# Altium project Concentrator.PrjPCB
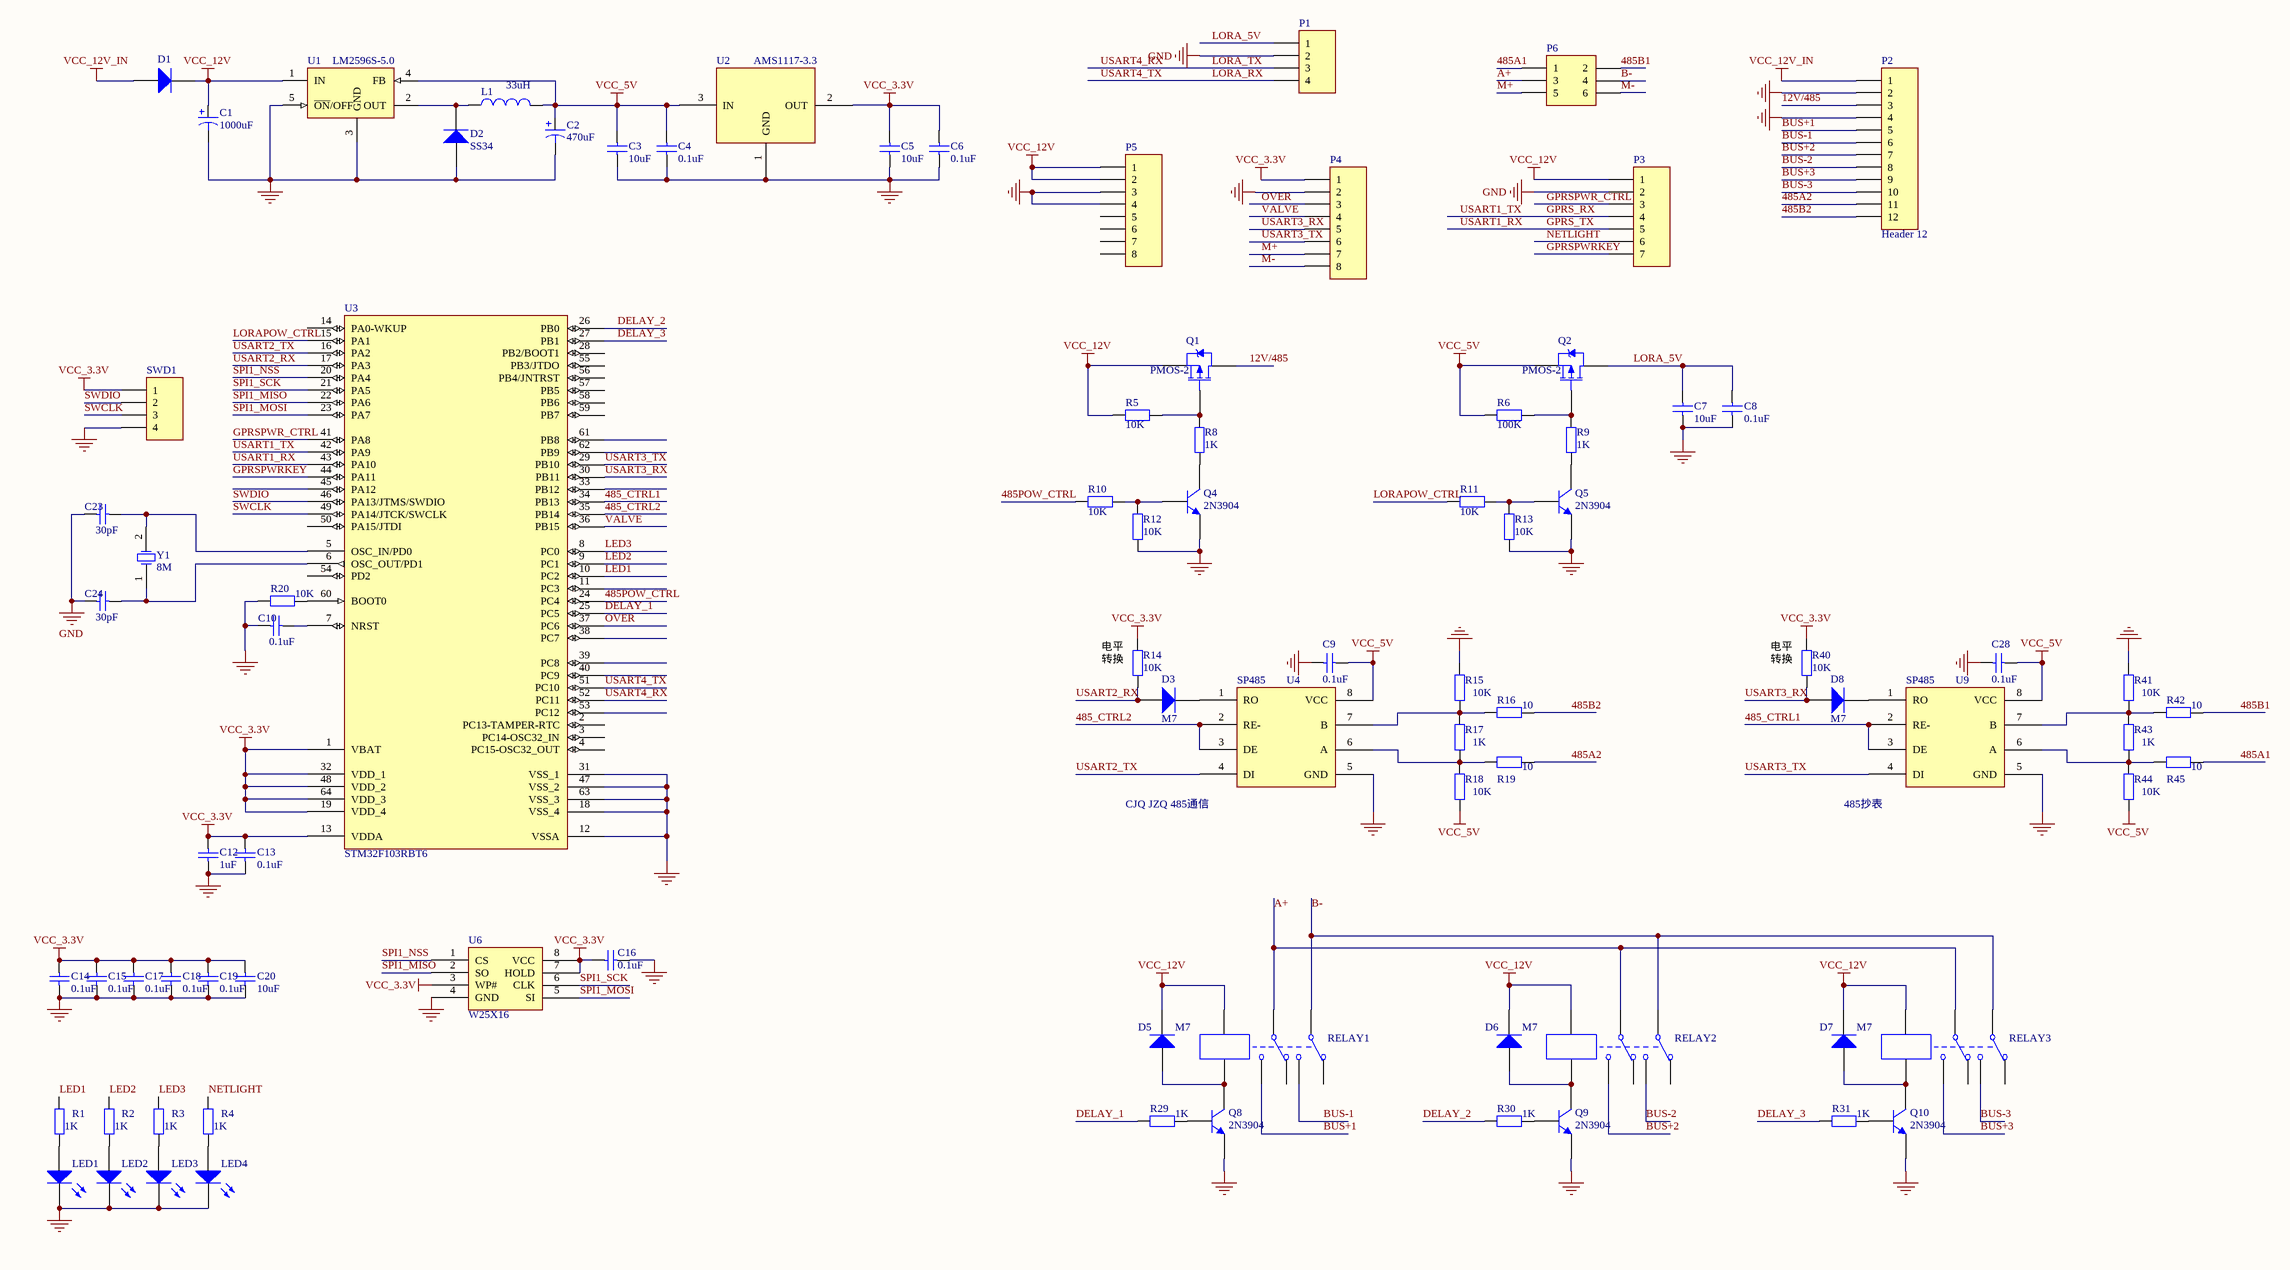
[diagram p0: Concentrator.SchDoc]
3 sheets, 167 parts. Net scope: global (net labels, ports and power ports of the same name join across sheets).
Board files: Concentrator.PcbDoc, SIM800.PcbDoc, Concentrator1.PcbDoc, MBUS_Slave.PcbDoc
Sheets:
  Concentrator.SchDoc
  SIM800.SchDoc
  JunPuMBUS.SchDoc

## Sheet Concentrator.SchDoc
size A2

### Parts
(Parts that share a designator on the sheet are numbered #1, #2 ... from top to bottom, then left to right.)
C1#1  value 1000uF  [C_DJ - duplicate]  (hidden comment: Cap Pol1)
C2#1  value 470uF  [C_DJ - duplicate]  (hidden comment: Cap Pol1)
C3#1  value 10uF  [0805]  (hidden comment: Cap)
C4#1  value 0.1uF  [0603]  (hidden comment: Cap)
C5#1  value 10uF  [0805]  (hidden comment: Cap)
C6#1  value 0.1uF  [0603]  (hidden comment: Cap)
C7  value 10uF  [0805]  (hidden comment: Cap)
C8  value 0.1uF  [0603]  (hidden comment: Cap)
C9  value 0.1uF  [0603]  (hidden comment: Cap)
C10  value 0.1uF  [0603]  (hidden comment: Cap)
C12  value 1uF  [0603]  (hidden comment: Cap)
C13  value 0.1uF  [0603]  (hidden comment: Cap)
C14  value 0.1uF  [0603]  (hidden comment: Cap)
C15  value 0.1uF  [0603]  (hidden comment: Cap)
C16  value 0.1uF  [0603]  (hidden comment: Cap)
C17  value 0.1uF  [0603]  (hidden comment: Cap)
C18  value 0.1uF  [0603]  (hidden comment: Cap)
C19  value 0.1uF  [0603]  (hidden comment: Cap)
C20  value 10uF  [0805]  (hidden comment: Cap)
C23#1  value 30pF  [0603]  (hidden comment: Cap)
C24#1  value 30pF  [0603]  (hidden comment: Cap)
C28  value 0.1uF  [0603]  (hidden comment: Cap)
D1  Diode 1N4007  [M7-4007]  (value not drawn)
D2  SS34  [M7-4007]
D3  M7  [M7-4007]
D5#1  M7  [M7-4007]
D6  M7  [M7-4007]
D7#1  M7  [M7-4007]
D8  M7  [M7-4007]
L1  value 33uH  [L12*12]  (hidden comment: Inductor)
LED1  LED  [LED]  (value not drawn)
LED2  LED  [LED]  (value not drawn)
LED3  LED  [LED]  (value not drawn)
LED4  LED  [LED]  (value not drawn)
P1  Header 4  [HDR1X4]  (value not drawn)
P2  Header 12  [P12]
P3  Header 7  [HDR1X7]  (value not drawn)
P4#1  Header 8  [HDR1X8]  (value not drawn)
P5#1  Header 8  [HDR1X8]  (value not drawn)
P6  Header 3X2  [HDR2X3]  (value not drawn)
Q1#1  PMOS-2  [78M05/20]
Q2#1  PMOS-2  [78M05/20]
Q4  2N3904  [NPN-PNP]
Q5  2N3904  [NPN-PNP]
Q8  2N3904  [NPN-PNP]
Q9  2N3904  [NPN-PNP]
Q10#1  2N3904  [NPN-PNP]
R1#1  value 1K  [0603]  (hidden comment: Res2)
R2#1  value 1K  [0603]  (hidden comment: Res2)
R3#1  value 1K  [0603]  (hidden comment: Res2)
R4#1  value 1K  [0603]  (hidden comment: Res2)
R5#1  value 10K  [0603]  (hidden comment: Res2)
R6#1  value 100K  [0603]  (hidden comment: Res2)
R8#1  value 1K  [0603]  (hidden comment: Res2)
R9#1  value 1K  [0603]  (hidden comment: Res2)
R10#1  value 10K  [0603]  (hidden comment: Res2)
R11#1  value 10K  [0603]  (hidden comment: Res2)
R12#1  value 10K  [0603]  (hidden comment: Res2)
R13#1  value 10K  [0603]  (hidden comment: Res2)
R14#1  value 10K  [0603]  (hidden comment: Res2)
R15#1  value 10K  [0603]  (hidden comment: Res2)
R16#1  value 10  [0603]  (hidden comment: Res2)
R17#1  value 1K  [0603]  (hidden comment: Res2)
R18#1  value 10K  [0603]  (hidden comment: Res2)
R19#1  value 10  [0603]  (hidden comment: Res2)
R20#1  value 10K  [0603]  (hidden comment: Res2)
R29#1  value 1K  [0603]  (hidden comment: Res2)
R30#1  value 1K  [0603]  (hidden comment: Res2)
R31#1  value 1K  [0603]  (hidden comment: Res2)
R40  value 10K  [0603]  (hidden comment: Res2)
R41  value 10K  [0603]  (hidden comment: Res2)
R42  value 10  [0603]  (hidden comment: Res2)
R43  value 1K  [0603]  (hidden comment: Res2)
R44  value 10K  [0603]  (hidden comment: Res2)
R45  value 10  [0603]  (hidden comment: Res2)
RELAY1#1  Relay-DPDT  [Relay-DPDP]  (value not drawn)
RELAY2  Relay-DPDT  [Relay-DPDP]  (value not drawn)
RELAY3  Relay-DPDT  [Relay-DPDP]  (value not drawn)
SWD1  SWD  [HDR1X4]  (value not drawn)
U1#1  LM2596S-5.0  [TO-263-5]
U2#1  AMS1117-3.3  [AMS-1117]
U3#1  STM32F103RBT6  [LQFP64_M]
U4#1  SP485  [SOP8]
U6  W25X16  [W24X16]
U9  SP485  [SOP8]
Y1  8M  [OSC]

### Nets
M-: C1#1.2 C2#1.2 C3#1.1 C4#1.1 C5#1.1 C6#1.1 C7.1 C8.1 C9.2 C10.1 C12.1 C13.1 C14.1 C15.1 C16.1 C17.1 C18.1 C19.1 C20.1 C23#1.1 C24#1.1 C28.2 D2.1(A) LED1.K LED2.K LED3.K LED4.K P1.2 P2.2 P2.4 P3.2 P4#1.2 P4#1.8 P5#1.3 P5#1.4 P6.6 Q4.E Q5.E Q8.E Q9.E Q10#1.E R12#1.1 R13#1.1 R15#1.1 R20#1.1 R41.1 SWD1.4 U1#1.3(GND) U1#1.5(~{ON}/OFF) U2#1.1(GND) U3#1.12(VSSA) U3#1.18(VSS_4) U3#1.31(VSS_1) U3#1.47(VSS_2) U3#1.63(VSS_3) U4#1.5(GND) U6.4(GND) U9.5(GND)  [also labelled GND]
VCC_3.3V: C5#1.2 C6#1.2 C12.2 C13.2 C14.2 C15.2 C16.2 C17.2 C18.2 C19.2 C20.2 P4#1.1 R14#1.1 R40.1 SWD1.1 U2#1.2(OUT) U3#1.1(VBAT) U3#1.13(VDDA) U3#1.19(VDD_4) U3#1.32(VDD_1) U3#1.48(VDD_2) U3#1.64(VDD_3) U6.3(WP#) U6.7(HOLD) U6.8(VCC)
VCC_5V: C2#1.1 C3#1.2 C4#1.2 C9.1 C28.1 L1.2 Q2#1.3(S) R6#1.2 R18#1.2 R44.2 U1#1.4(FB) U2#1.3(IN) U4#1.8(VCC) U9.8(VCC)
VCC_12V: C1#1.1 D1.2(K) D5#1.2(K) D6.2(K) D7#1.2(K) P3.1 P5#1.1 P5#1.2 Q1#1.3(S) R5#1.2 RELAY1#1.7 RELAY2.7 RELAY3.7 U1#1.1(IN)
VCC_12V_IN: D1.1(A) P2.1
12V/485: P2.3 Q1#1.2(D)
485_CTRL1: U3#1.34(PB13) U9.2(RE-) U9.3(DE)
485_CTRL2: U3#1.35(PB14) U4#1.2(RE-) U4#1.3(DE)
485A1: P6.1 R45.2
485A2: P2.11 R19#1.2
485B1: P6.2 R42.2
485B2: P2.12 R16#1.2
485POW_CTRL: R10#1.1 U3#1.24(PC4)
A+: P6.3 RELAY1#1.4 RELAY2.4 RELAY3.4
B-: P6.4 RELAY1#1.1 RELAY2.1 RELAY3.1
BUS+1: P2.5 RELAY1#1.6
BUS+2: P2.7 RELAY2.6
BUS+3: P2.9 RELAY3.6
BUS-1: P2.6 RELAY1#1.3
BUS-2: P2.8 RELAY2.3
BUS-3: P2.10 RELAY3.3
DELAY_1: R29#1.1 U3#1.25(PC5)
DELAY_2: R30#1.1 U3#1.26(PB0)
DELAY_3: R31#1.1 U3#1.27(PB1)
GPRS_RX: P3.4 U3#1.42(PA9)  [also labelled USART1_TX]
GPRS_TX: P3.5 U3#1.43(PA10)  [also labelled USART1_RX]
GPRSPWR_CTRL: P3.3 U3#1.41(PA8)
GPRSPWRKEY: P3.7 U3#1.44(PA11)
LED1: R1#1.1 U3#1.10(PC2)
LED2: R2#1.1 U3#1.9(PC1)
LED3: R3#1.1 U3#1.8(PC0)
LORA_5V: C7.2 C8.2 P1.1 Q2#1.2(D)
LORA_RX: P1.4 U3#1.51(PC10)  [also labelled USART4_TX]
LORA_TX: P1.3 U3#1.52(PC11)  [also labelled USART4_RX]
LORAPOW_CTRL: R11#1.1 U3#1.15(PA1)
M+: P4#1.7 P6.5
NETLIGHT: P3.6 R4#1.1
OVER: P4#1.3 U3#1.37(PC6)
SPI1_MISO: U3#1.22(PA6) U6.2(SO)
SPI1_MOSI: U3#1.23(PA7) U6.5(SI)
SPI1_NSS: U3#1.20(PA4) U6.1(CS)
SPI1_SCK: U3#1.21(PA5) U6.6(CLK)
SWCLK: SWD1.3 U3#1.49(PA14/JTCK/SWCLK)
SWDIO: SWD1.2 U3#1.46(PA13/JTMS/SWDIO)
USART2_RX: D3.1(A) R14#1.2 U3#1.17(PA3)
USART2_TX: U3#1.16(PA2) U4#1.4(DI)
USART3_RX: D8.1(A) P4#1.5 R40.2 U3#1.30(PB11)
USART3_TX: P4#1.6 U3#1.29(PB10) U9.4(DI)
VALVE: P4#1.4 U3#1.36(PB15)
NetC10_2: C10.2 U3#1.7(NRST)
NetC23#1_2: C23#1.2 U3#1.5(OSC_IN/PD0) Y1.2(OSC2)
NetC24#1_2: C24#1.2 U3#1.6(OSC_OUT/PD1) Y1.1(OSC1)
NetD2_2: D2.2(K) L1.1 U1#1.2(OUT)
NetD3_2: D3.2(K) U4#1.1(RO)
NetD5#1_1: D5#1.1(A) Q8.C RELAY1#1.8
NetD6_1: D6.1(A) Q9.C RELAY2.8
NetD7#1_1: D7#1.1(A) Q10#1.C RELAY3.8
NetD8_2: D8.2(K) U9.1(RO)
NetLED1_A: LED1.A R1#1.2
NetLED2_A: LED2.A R2#1.2
NetLED3_A: LED3.A R3#1.2
NetLED4_A: LED4.A R4#1.2
NetQ1#1_1: Q1#1.1(G) R5#1.1 R8#1.2
NetQ2#1_1: Q2#1.1(G) R6#1.1 R9#1.2
NetQ4_B: Q4.B R10#1.2 R12#1.2
NetQ4_C: Q4.C R8#1.1
NetQ5_B: Q5.B R11#1.2 R13#1.2
NetQ5_C: Q5.C R9#1.1
NetQ8_B: Q8.B R29#1.2
NetQ9_B: Q9.B R30#1.2
NetQ10#1_B: Q10#1.B R31#1.2
NetR15#1_2: R15#1.2 R16#1.1 R17#1.1 U4#1.7(B)
NetR17#1_2: R17#1.2 R18#1.1 R19#1.1 U4#1.6(A)
NetR20#1_2: R20#1.2 U3#1.60(BOOT0)
NetR41_2: R41.2 R42.1 R43.1 U9.7(B)
NetR43_2: R43.2 R44.1 R45.1 U9.6(A)

Not connected (* = marked no-connect by the designer): P5#1 5 6 7 8; RELAY1#1 2 5; RELAY2 2 5; RELAY3 2 5; U2#1 4(OUT); U3#1 2(PC13-TAMPER-RTC) 3(PC14-OSC32_IN) 4(PC15-OSC32_OUT) 11(PC3) 14(PA0-WKUP) 28(PB2/BOOT1) 33(PB12) 38(PC7) 39(PC8) 40(PC9) 45(PA12) 50(PA15/JTDI) 53(PC12) 54(PD2) 55(PB3/JTDO) 56(PB4/JNTRST) 57(PB5) 58(PB6) 59(PB7) 61(PB8) 62(PB9)

### Notes on the sheet
- (near R14#1) 电平
  转换
- (near R40) 电平
  转换
- (near U4#1) CJQ JZQ 485通信
- (near U9) 485抄表

### Library data of the parts
C1#1 C2#1 = Cap Pol1: Polarized Capacitor (Radial); Published: 8-Jun-2000; LatestRevisionDate: 17-Jul-2002; LatestRevisionNote: Re-released for DXP Platform.; PackageReference: RB7.6-15; Publisher: Altium Limited
C3#1 C4#1 C5#1 C6#1 C7-C10 C12-C20 C23#1 C24#1 C28 = Cap: Capacitor; Published: 8-Jun-2000; LatestRevisionDate: 17-Jul-2002; LatestRevisionNote: Re-released for DXP Platform.; PackageReference: RAD-0.3; Publisher: Altium Limited
D1-D3 D5#1 D6 D7#1 D8 = Diode 1N4007: 1 Amp General Purpose Rectifier; Published: 8-Jun-2000; LatestRevisionDate: 17-Jul-2002; LatestRevisionNote: Re-released for DXP Platform.; PackageReference: DO-41; Publisher: Altium Limited; Code_JEDEC: DO-204-AL; ComponentLink1Description: Manufacturer Link; ComponentLink1URL: http://www.fairchildsemi.com/; ComponentLink2Description: Datasheet; ComponentLink2URL: http://www.fairchildsemi.com/ds/1N%2F1N4001.pdf
  D1 D2: DatasheetVersion: 1998; PackageVersion: Aug-1999
  D3 D5#1 D6 D7#1 D8: DatasheetDocument: 1998; PackageDocument: Aug-1999
L1 = Inductor: Code_IEC: 1005; Published: 8-Jun-2000; LatestRevisionDate: 29-May-2009; LatestRevisionNote: IPC-7351 Footprint Added.; PackageReference: 0402-A; Publisher: Altium Limited; PackageDescription: Chip Inductor; Code_JEITA: 0402
LED1-LED4 = LED0: Typical INFRARED GaAs LED; Published: 8-Jun-2000; LatestRevisionDate: 08-Jul-2005; LatestRevisionNote: Mech Layer 1 removed.; PackageReference: LED-0; Publisher: Altium Limited
P1 SWD1 = Header 4: Header, 4-Pin; LatestRevisionDate: 17-Jul-2002; LatestRevisionNote: Re-released for DXP Platform.; Publisher: Altium Limited
P2 = Header 12: Header, 12-Pin; LatestRevisionDate: 17-Jul-2002; LatestRevisionNote: Re-released for DXP Platform.; Publisher: Altium Limited
P3 = Header 7: Header, 7-Pin; LatestRevisionDate: 17-Jul-2002; LatestRevisionNote: Re-released for DXP Platform.; Publisher: Altium Limited
P4#1 P5#1 = Header 8: Header, 8-Pin; LatestRevisionDate: 17-Jul-2002; LatestRevisionNote: Re-released for DXP Platform.; Publisher: Altium Limited
P6 = Header 3X2: Header, 3-Pin, Dual row; LatestRevisionDate: 17-Jul-2002; LatestRevisionNote: Re-released for DXP Platform.; Publisher: Altium Limited
Q1#1 Q2#1 = PMOS-2: P-Channel Power MOSFET; Note: Pin 4 not drawn and electrically connected to Pin 2.; Published: 8-Jun-2000; LatestRevisionDate: 17-Jul-2002; LatestRevisionNote: Re-released for DXP Platform.; DatasheetVersion: PD-9.390D; PackageReference: TO-220AB; Publisher: Altium Limited; Code_JEDEC: TO-220-AB; ComponentLink1Description: Manufacturer Link; ComponentLink1URL: http://www.irf.com/
Q4 Q5 Q8 Q9 Q10#1 = 2N3904: NPN General Purpose Amplifier; Published: 8-Jun-2000; LatestRevisionDate: 15-Jan-2003; LatestRevisionNote: PCB Footprint 'BCY-W3/D4.7' replaced; PackageReference: TO-92A; Publisher: Altium Limited; Code_JEDEC: TO-92A; ComponentLink1Description: Manufacturer Link; ComponentLink1URL: http://www.fairchildsemi.com/; ComponentLink2Description: Datasheet; ComponentLink2URL: http://www.fairchildsemi.com/ds/2N%2F2N3904.pdf
  Q4 Q5: DatasheetVersion: 1997; PackageVersion: Sep-1998
  Q8 Q9 Q10#1: DatasheetDocument: 1997; PackageDocument: Sep-1998
R1#1 R2#1 R3#1 R4#1 R5#1 R6#1 R8#1 R9#1 R10#1 R11#1 R12#1 R13#1 R14#1 R15#1 R16#1 R17#1 R18#1 R19#1 R20#1 R29#1 R30#1 R31#1 R40-R45 = Res2: Resistor; Published: 8-Jun-2000; LatestRevisionDate: 17-Jul-2002; LatestRevisionNote: Re-released for DXP Platform.; PackageReference: AXIAL-0.4; Publisher: Altium Limited
RELAY1#1 RELAY2 RELAY3 = Relay-DPDT: Dual-Pole Dual-Throw Relay; Published: 24-Mar-1999; LatestRevisionDate: 17-Jul-2002; LatestRevisionNote: Re-released for DXP Platform.; PackageReference: DIP-P8; Publisher: Altium Limited
U1#1 = LM2596S-5.0: 5V稳压芯片; Note: Tab is connected to GND; Published: 15-Apr-2002; DatasheetVersion: Dec-1997; PackageReference: TS5B; Publisher: Altium Limited; PackageDescription: D2-PAK; 5 Leads; Body 14.4 (inc. leads) x 10.4 mm (LxW max); ComponentLink1Description: Manufacturer Link; ComponentLink1URL: http://www.national.com/; ComponentLink2Description: Datasheet; ComponentLink2URL: http://www.national.com/ds.cgi/LM/LM2596.pdf; ComponentLink3Description: URL Link1; ComponentLink3URL: http://www.national.com/pf/LM/LM2596.html
U3#1 = STM32F103RBT6: STM32 ARM-based 32-bit MCU with 128 Kbytes Flash, 64-pin LQFP, Industrial Temperature; Published: 30-May-2008; DatasheetVersion: rev6, Mar-2008; PackageVersion: Mar-2008; PackageReference: LQFP64; Publisher: Altium Limited; PackageDescription: 64-Pin Low-Profile Quad Flat Pack, 10 x 10 mm Body, 0.5 mm Pitch (LQFP64); ComponentLink1Description: Manufacturer Link; ComponentLink1URL: www.st.com/stm32; ComponentLink2Description: Datasheet; ComponentLink2URL: http://www.st.com/stonline/products/literature/ds/13587.pdf
U4#1 U9 = Pro55.tmp_SP485_20
U6 = W24X16
Y1 = XTAL: Crystal Oscillator; Published: 8-Jun-2000; LatestRevisionDate: 17-Jul-2002; LatestRevisionNote: Re-released for DXP Platform.; PackageReference: R38; Publisher: Altium Limited

## Sheet SIM800.SchDoc
size A4
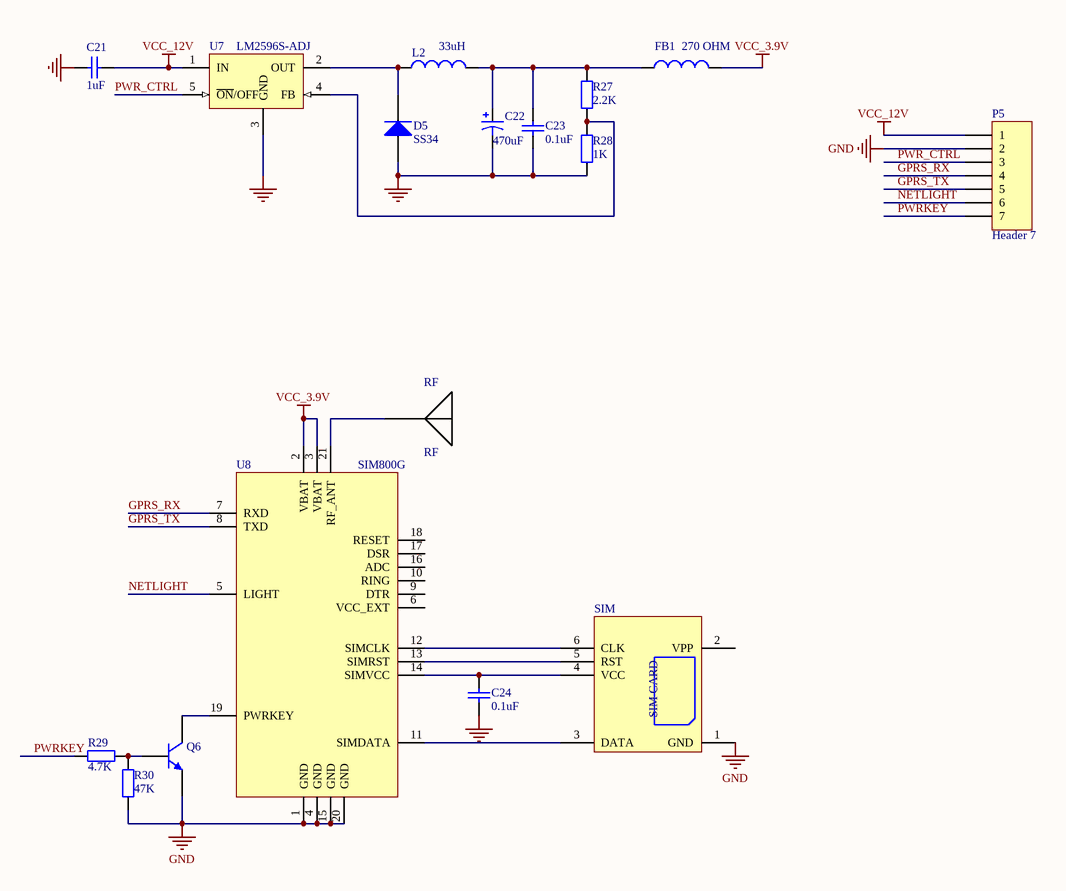
[diagram p1: SIM800.SchDoc]

### Parts
(Parts that share a designator on the sheet are numbered #1, #2 ... from top to bottom, then left to right.)
C21  value 1uF  [0603]  (hidden comment: Cap)
C22  value 470uF  [C_DJ - duplicate]  (hidden comment: Cap Pol1)
C23#2  value 0.1uF  [0603]  (hidden comment: Cap)
C24#2  value 0.1uF  [0603]  (hidden comment: Cap)
D5#2  SS34  [M7-4007]
FB1  value 270 OHM  [0805]  (hidden comment: Inductor)
L2  value 33uH  [L12*12]  (hidden comment: Inductor)
P5#2  Header 7  [HDR1X7]
Q6  (no value)  [NPN-PNP]
R27#1  value 2.2K  [0603]  (hidden comment: Res2)
R28#1  value 1K  [0603]  (hidden comment: Res2)
R29#2  value 4.7K  [0603]  (hidden comment: Res2)
R30#2  value 47K  [0603]  (hidden comment: Res2)
RF  RF  [RF_2]
SIM  (no value)  [SIMCARD]
U7  LM2596S-ADJ  [TO-263-5]
U8  SIM800G  [M590E_1]

### Nets
GND: C21.2 C22.2 C23#2.1 C24#2.2 D5#2.1(A) P5#2.2 Q6.E R28#1.2 R30#2.2 SIM.1(GND) U7.3(GND) U8.1(GND) U8.4(GND) U8.15(GND) U8.20(GND)  [project net M-]
VCC_3.9V: FB1.2 U8.2(VBAT) U8.3(VBAT)
VCC_12V: C21.1 P5#2.1 U7.1(IN)
GPRS_RX: P5#2.4 U8.7(RXD)
GPRS_TX: P5#2.5 U8.8(TXD)
NETLIGHT: P5#2.6 U8.5(LIGHT)
PWR_CTRL: P5#2.3 U7.5(~{ON}/OFF)
PWRKEY: P5#2.7 R29#2.1
NetC22_1: C22.1 C23#2.2 FB1.1 L2.2 R27#1.1
NetC24#2_1: C24#2.1 SIM.4(VCC) U8.14(SIMVCC)
NetD5#2_2: D5#2.2(K) L2.1 U7.2(OUT)
NetQ6_B: Q6.B R29#2.2 R30#2.1
NetQ6_C: Q6.C U8.19(PWRKEY)
NetR27#1_2: R27#1.2 R28#1.1 U7.4(FB)
NetRF_1: RF.1(RF) U8.21(RF_ANT)
NetSIM_3: SIM.3(DATA) U8.11(SIMDATA)
NetSIM_5: SIM.5(RST) U8.13(SIMRST)
NetSIM_6: SIM.6(CLK) U8.12(SIMCLK)

Not connected (* = marked no-connect by the designer): SIM 2(VPP); U8 6(VCC_EXT) 9(DTR) 10(RING) 16(ADC) 17(DSR) 18(RESET)

### Library data of the parts
C21 C23#2 C24#2 = Cap: Capacitor; Published: 8-Jun-2000; LatestRevisionDate: 17-Jul-2002; LatestRevisionNote: Re-released for DXP Platform.; PackageReference: RAD-0.3; Publisher: Altium Limited
C22 = Cap Pol1: Polarized Capacitor (Radial); Published: 8-Jun-2000; LatestRevisionDate: 17-Jul-2002; LatestRevisionNote: Re-released for DXP Platform.; PackageReference: RB7.6-15; Publisher: Altium Limited
D5#2 = Diode 1N4007: 1 Amp General Purpose Rectifier; Published: 8-Jun-2000; LatestRevisionDate: 17-Jul-2002; LatestRevisionNote: Re-released for DXP Platform.; DatasheetVersion: 1998; PackageVersion: Aug-1999; PackageReference: DO-41; Publisher: Altium Limited; Code_JEDEC: DO-204-AL; ComponentLink1Description: Manufacturer Link; ComponentLink1URL: http://www.fairchildsemi.com/; ComponentLink2Description: Datasheet; ComponentLink2URL: http://www.fairchildsemi.com/ds/1N%2F1N4001.pdf
FB1 L2 = Inductor: Code_IEC: 1005; Published: 8-Jun-2000; LatestRevisionDate: 29-May-2009; LatestRevisionNote: IPC-7351 Footprint Added.; PackageReference: 0402-A; Publisher: Altium Limited; PackageDescription: Chip Inductor; Code_JEITA: 0402
P5#2 = Header 7: Header, 7-Pin; LatestRevisionDate: 17-Jul-2002; LatestRevisionNote: Re-released for DXP Platform.; Publisher: Altium Limited
Q6 = 2N3904: NPN General Purpose Amplifier; Published: 8-Jun-2000; LatestRevisionDate: 15-Jan-2003; LatestRevisionNote: PCB Footprint 'BCY-W3/D4.7' replaced; DatasheetDocument: 1997; PackageDocument: Sep-1998; PackageReference: TO-92A; Publisher: Altium Limited; Code_JEDEC: TO-92A; ComponentLink1Description: Manufacturer Link; ComponentLink1URL: http://www.fairchildsemi.com/; ComponentLink2Description: Datasheet; ComponentLink2URL: http://www.fairchildsemi.com/ds/2N%2F2N3904.pdf
R27#1 R28#1 R29#2 R30#2 = Res2: Resistor; Published: 8-Jun-2000; LatestRevisionDate: 17-Jul-2002; LatestRevisionNote: Re-released for DXP Platform.; PackageReference: AXIAL-0.4; Publisher: Altium Limited
SIM = SIM_CARD: SIM CARD
U7 = LM2596S-5.0: 5V稳压芯片; Note: Tab is connected to GND; Published: 15-Apr-2002; DatasheetVersion: Dec-1997; PackageReference: TS5B; Publisher: Altium Limited; PackageDescription: D2-PAK; 5 Leads; Body 14.4 (inc. leads) x 10.4 mm (LxW max); ComponentLink1Description: Manufacturer Link; ComponentLink1URL: http://www.national.com/; ComponentLink2Description: Datasheet; ComponentLink2URL: http://www.national.com/ds.cgi/LM/LM2596.pdf; ComponentLink3Description: URL Link1; ComponentLink3URL: http://www.national.com/pf/LM/LM2596.html
U8 = M590

## Sheet JunPuMBUS.SchDoc
size A3
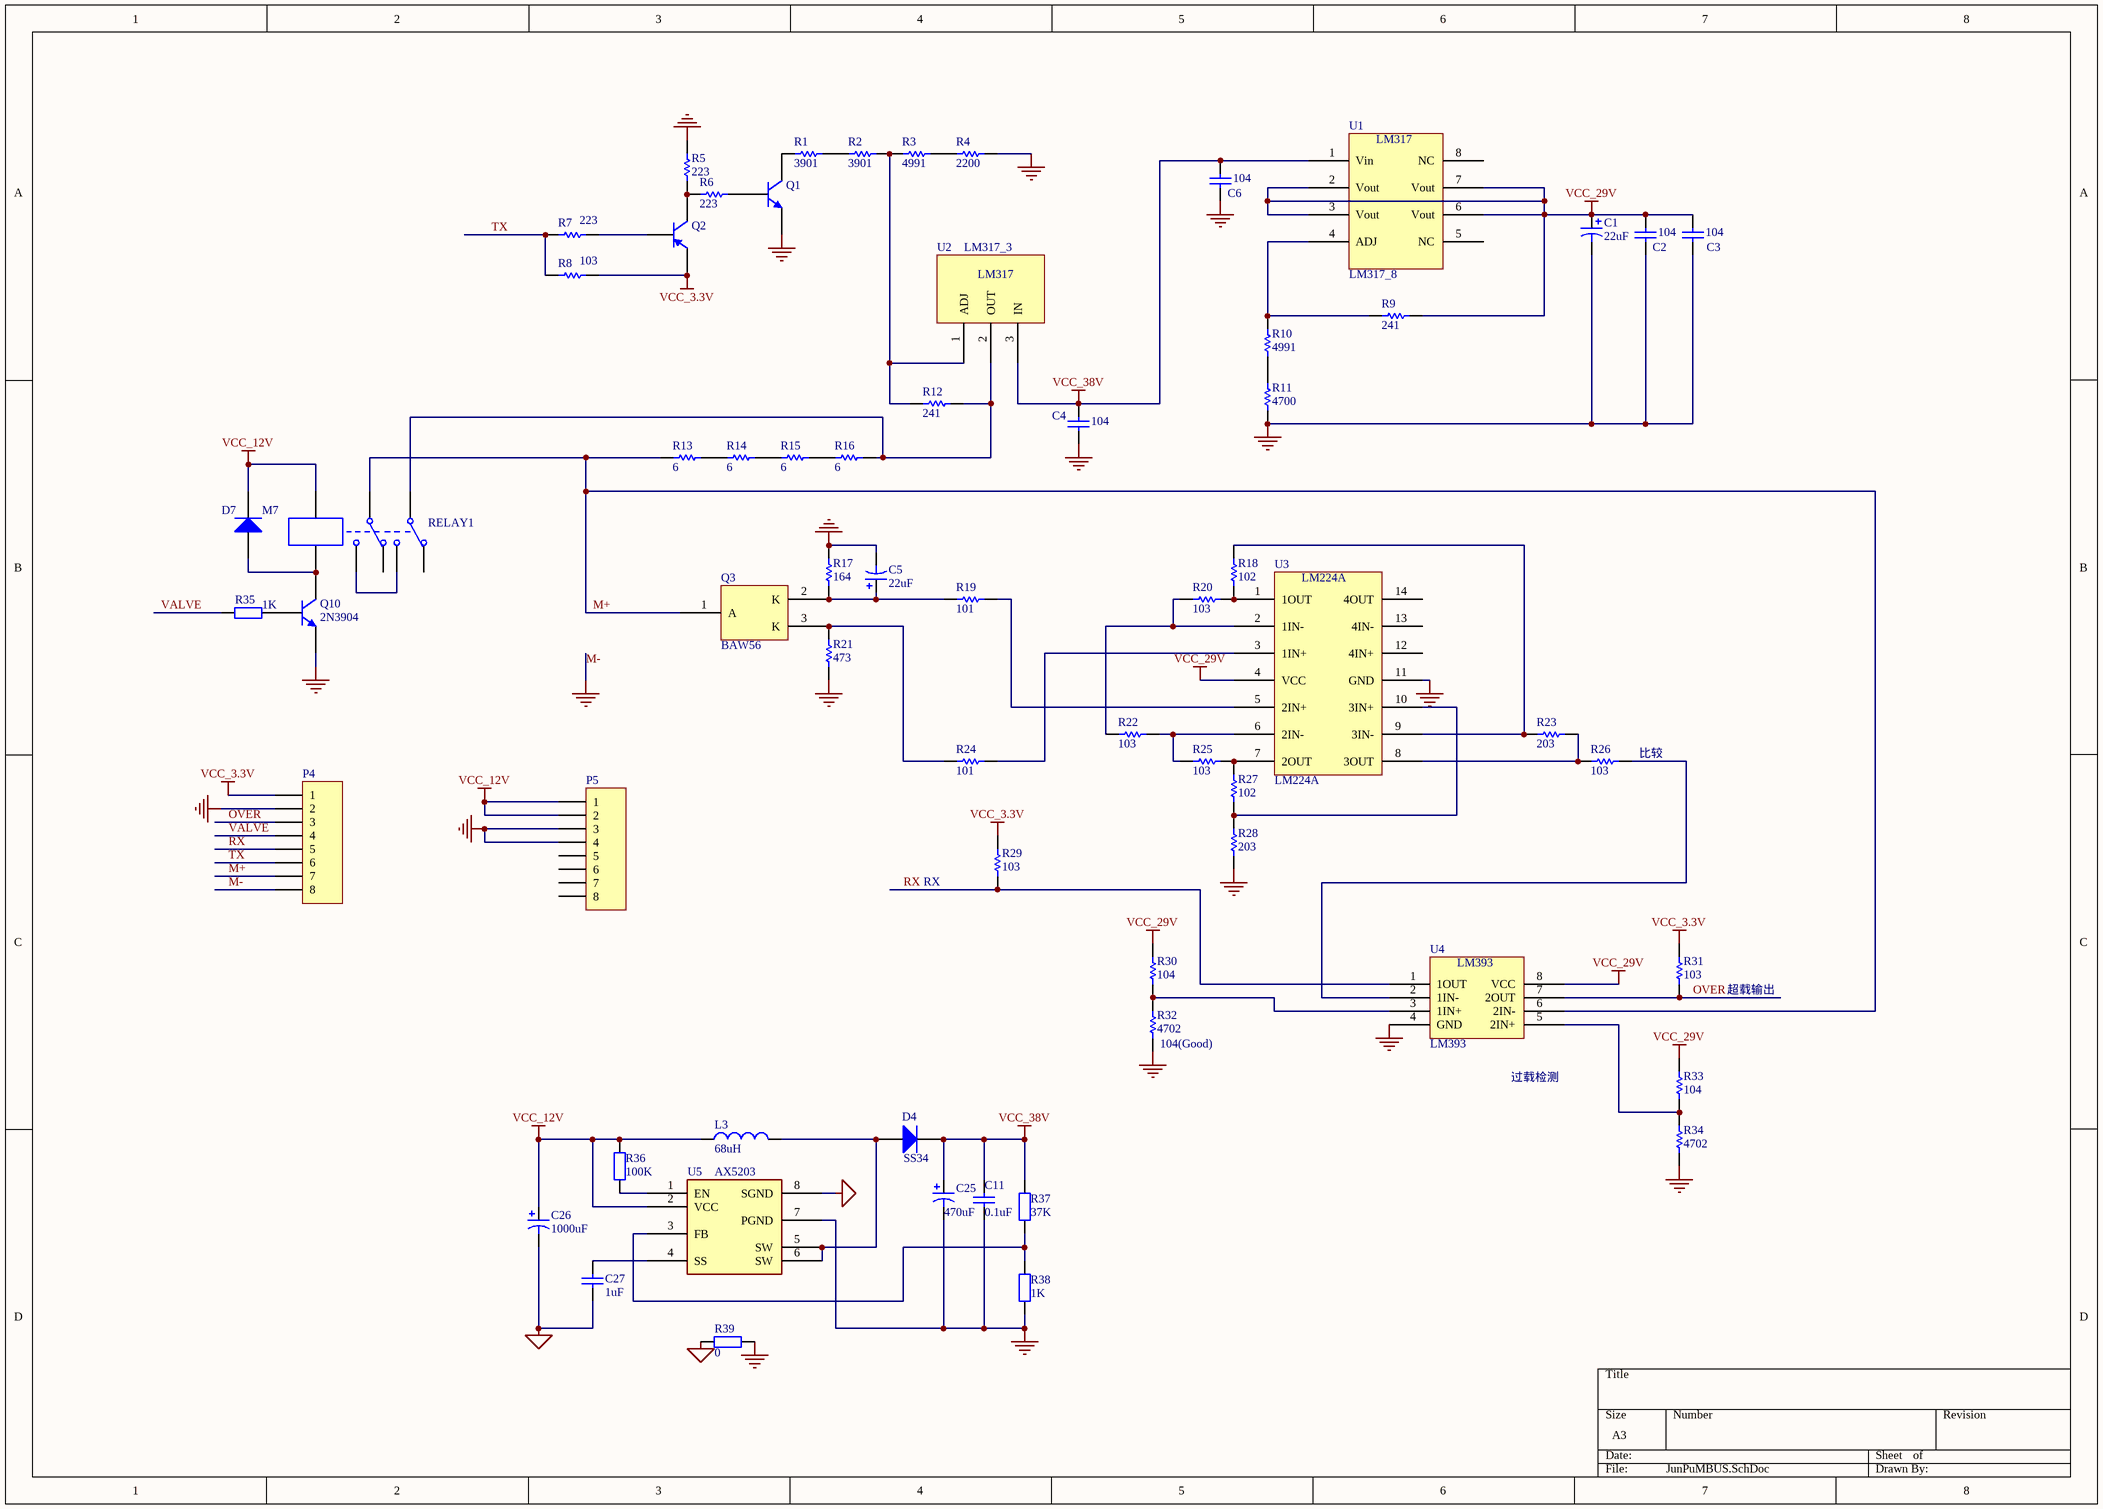
[diagram p2: JunPuMBUS.SchDoc]

### Parts
(Parts that share a designator on the sheet are numbered #1, #2 ... from top to bottom, then left to right.)
C1#2  value 22uF  [C_6.3_5.3]  (hidden comment: Cap Pol3)
C2#2  value 104  [0603]  (hidden comment: Cap)
C3#2  value 104  [0603]  (hidden comment: Cap)
C4#2  value 104  [0603]  (hidden comment: Cap)
C5#2  value 22uF  [C_6.3_5.3]  (hidden comment: Cap Pol3)
C6#2  value 104  [0603]  (hidden comment: Cap)
C11  value 0.1uF  [0603]  (hidden comment: Cap)
C25  value 470uF  [C_DJ - duplicate]  (hidden comment: Cap Pol1)
C26  value 1000uF  [C_DJ - duplicate]  (hidden comment: Cap Pol1)
C27  value 1uF  [0603]  (hidden comment: Cap)
D4  SS34  [M7-4007]
D7#2  M7  [M7-4007]
L3  value 68uH  [L12*12]  (hidden comment: Inductor)
P4#2  Header 8  [HDR1X8]  (value not drawn)
P5#3  Header 8  [HDR1X8]  (value not drawn)
Q1#2  NPN  [SOT-23]  (value not drawn)
Q2#2  PNP  [SOT-23]  (value not drawn)
Q3  BAW56  [SOT-23]
Q10#2  2N3904  [NPN-PNP]
R1#2  value 3901  [1206]  (hidden comment: Res1)
R2#2  value 3901  [1206]  (hidden comment: Res1)
R3#2  value 4991  [1206]  (hidden comment: Res1)
R4#2  value 2200  [1206]  (hidden comment: Res1)
R5#2  value 223  [0603]  (hidden comment: Res1)
R6#2  value 223  [0603]  (hidden comment: Res1)
R7  value 223  [0603]  (hidden comment: Res1)
R8#2  value 103  [0603]  (hidden comment: Res1)
R9#2  value 241  [1206]  (hidden comment: Res1)
R10#2  value 4991  [1206]  (hidden comment: Res1)
R11#2  value 4700  [1206]  (hidden comment: Res1)
R12#2  value 241  [1206]  (hidden comment: Res1)
R13#2  value 6  [2512]  (hidden comment: Res1)
R14#2  value 6  [2512]  (hidden comment: Res1)
R15#2  value 6  [2512]  (hidden comment: Res1)
R16#2  value 6  [2512]  (hidden comment: Res1)
R17#2  value 164  [0603]  (hidden comment: Res1)
R18#2  value 102  [0603]  (hidden comment: Res1)
R19#2  value 101  [0603]  (hidden comment: Res1)
R20#2  value 103  [0603]  (hidden comment: Res1)
R21  value 473  [0603]  (hidden comment: Res1)
R22  value 103  [0603]  (hidden comment: Res1)
R23  value 203  [0603]  (hidden comment: Res1)
R24  value 101  [0603]  (hidden comment: Res1)
R25  value 103  [0603]  (hidden comment: Res1)
R26  value 103  [0603]  (hidden comment: Res1)
R27#2  value 102  [0603]  (hidden comment: Res1)
R28#2  value 203  [0603]  (hidden comment: Res1)
R29#3  value 103  [0603]  (hidden comment: Res1)
R30#3  value 104  [1206]  (hidden comment: Res1)
R31#2  value 103  [0603]  (hidden comment: Res1)
R32  104(Good)  value 4702  [1206]
R33  value 104  [1206]  (hidden comment: Res1)
R34  value 4702  [1206]  (hidden comment: Res1)
R35  value 1K  [0603]  (hidden comment: Res2)
R36  value 100K  [0603]  (hidden comment: Res2)
R37  value 37K  [0603]  (hidden comment: Res2)
R38  value 1K  [0603]  (hidden comment: Res2)
R39  value 0  [0603]  (hidden comment: Res2)
RELAY1#2  Relay-DPDT  [Relay-DPDP]  (value not drawn)
U1#2  LM317_8  [SOP8]
U2#2  LM317_3  [LM317_3]
U3#2  LM224A  [SOP14]
U4#2  LM393  [SOP8]
U5  AX5203  [SOP8]

### Nets
M-: C1#2.2 C2#2.1 C3#2.1 C4#2.1 C5#2.2 C6#2.1 C11.1 C25.2 P4#2.2 P4#2.8 P5#3.3 P5#3.4 Q1#2.3(E) Q10#2.E R4#2.1 R5#2.2 R11#2.2 R17#2.2 R21.1 R28#2.2 R32.2 R34.2 R38.2 R39.1 U3#2.11(GND) U4#2.4(GND) U5.7(PGND)  [also labelled GND]
SGND: C26.2 C27.1 R39.2 U5.8(SGND)
VCC_3.3V: P4#2.1 Q2#2.3(E) R8#2.2 R29#3.2 R31#2.2
VCC_12V: C26.1 D7#2.2(K) L3.2 P5#3.1 P5#3.2 R36.1 RELAY1#2.7 U5.2(VCC)
VCC_29V: C1#2.1 C2#2.2 C3#2.2 R9#2.1 R30#3.1 R33.1 U1#2.2(Vout) U1#2.3(Vout) U1#2.6(Vout) U1#2.7(Vout) U3#2.4(VCC) U4#2.8(VCC)
VCC_38V: C4#2.2 C6#2.2 C11.2 C25.1 D4.2(K) R37.1 U1#2.1(Vin) U2#2.3(IN)
M+: P4#2.7 Q3.1(A) R13#2.1 RELAY1#2.4 U4#2.6(2IN-)
OVER: P4#2.3 R31#2.1 U4#2.7(2OUT)
RX: P4#2.5 R29#3.1 U4#2.1(1OUT)
TX: P4#2.6 R7.1 R8#2.1
VALVE: P4#2.4 R35.1
NetC5#2_1: C5#2.1 Q3.2(K) R17#2.1 R19#2.1
NetC27_2: C27.2 U5.4(SS)
NetD4_1: D4.1(A) L3.1 U5.5(SW) U5.6(SW)
NetD7#2_1: D7#2.1(A) Q10#2.C RELAY1#2.8
NetQ1#2_1: Q1#2.1(C) R1#2.2
NetQ1#2_2: Q1#2.2(B) R6#2.1
NetQ2#2_1: Q2#2.1(C) R5#2.1 R6#2.2
NetQ2#2_2: Q2#2.2(B) R7.2
NetQ3_3: Q3.3(K) R21.2 R24.1
NetQ10#2_B: Q10#2.B R35.2
NetR1#2_1: R1#2.1 R2#2.2
NetR2#2_1: R2#2.1 R3#2.2 R12#2.2 U2#2.1(ADJ)
NetR3#2_1: R3#2.1 R4#2.2
NetR9#2_2: R9#2.2 R10#2.1 U1#2.4(ADJ)
NetR10#2_2: R10#2.2 R11#2.1
NetR12#2_1: R12#2.1 R16#2.2 RELAY1#2.1 U2#2.2(OUT)
NetR13#2_2: R13#2.2 R14#2.1
NetR14#2_2: R14#2.2 R15#2.1
NetR15#2_2: R15#2.2 R16#2.1
NetR18#2_1: R18#2.1 R23.2 U3#2.9(3IN-)
NetR18#2_2: R18#2.2 R20#2.1 U3#2.1(1OUT)
NetR19#2_2: R19#2.2 U3#2.5(2IN+)
NetR20#2_2: R20#2.2 R22.1 U3#2.2(1IN-)
NetR22_2: R22.2 R25.2 U3#2.6(2IN-)
NetR23_1: R23.1 R26.2 U3#2.8(3OUT)
NetR24_2: R24.2 U3#2.3(1IN+)
NetR25_1: R25.1 R27#2.1 U3#2.7(2OUT)
NetR26_1: R26.1 U4#2.2(1IN-)
NetR27#2_2: R27#2.2 R28#2.1 U3#2.10(3IN+)
NetR30#3_2: R30#3.2 R32.1 U4#2.3(1IN+)
NetR33_2: R33.2 R34.1 U4#2.5(2IN+)
NetR36_2: R36.2 U5.1(EN)
NetR37_2: R37.2 R38.1 U5.3(FB)
NetRELAY1#2_3: RELAY1#2.3 RELAY1#2.6

Not connected (* = marked no-connect by the designer): P5#3 5 6 7 8; RELAY1#2 2 5; U1#2 5(NC) 8(NC); U3#2 12(4IN+) 13(4IN-) 14(4OUT)

### Notes on the sheet
- (near R26) 比较
- RX
- (near R31#2) 超载输出
- (near U4#2) 过载检测
- (in symbol LM317_3) LM317
- (in symbol LM317_8) LM317

### Library data of the parts
C1#2 C5#2 = Cap Pol3: Polarized Capacitor (Surface Mount); Published: 8-Jun-2000; LatestRevisionDate: 17-Jul-2002; LatestRevisionNote: Re-released for DXP Platform.; PackageReference: C0805; Publisher: Altium Limited
C2#2 C3#2 C4#2 C6#2 C11 C27 = Cap: Capacitor; Published: 8-Jun-2000; LatestRevisionDate: 17-Jul-2002; LatestRevisionNote: Re-released for DXP Platform.; PackageReference: RAD-0.3; Publisher: Altium Limited
C25 C26 = Cap Pol1: Polarized Capacitor (Radial); Published: 8-Jun-2000; LatestRevisionDate: 17-Jul-2002; LatestRevisionNote: Re-released for DXP Platform.; PackageReference: RB7.6-15; Publisher: Altium Limited
D4 D7#2 = Diode 1N4007: 1 Amp General Purpose Rectifier; Published: 8-Jun-2000; LatestRevisionDate: 17-Jul-2002; LatestRevisionNote: Re-released for DXP Platform.; PackageReference: DO-41; Publisher: Altium Limited; Code_JEDEC: DO-204-AL; ComponentLink1Description: Manufacturer Link; ComponentLink1URL: http://www.fairchildsemi.com/; ComponentLink2Description: Datasheet; ComponentLink2URL: http://www.fairchildsemi.com/ds/1N%2F1N4001.pdf
  D4: DatasheetVersion: 1998; PackageVersion: Aug-1999
  D7#2: DatasheetDocument: 1998; PackageDocument: Aug-1999
L3 = Inductor: Code_IEC: 1005; Published: 8-Jun-2000; LatestRevisionDate: 29-May-2009; LatestRevisionNote: IPC-7351 Footprint Added.; PackageReference: 0402-A; Publisher: Altium Limited; PackageDescription: Chip Inductor; Code_JEITA: 0402
P4#2 P5#3 = Header 8: Header, 8-Pin; LatestRevisionDate: 17-Jul-2002; LatestRevisionNote: Re-released for DXP Platform.; Publisher: Altium Limited
Q1#2 = NPN: NPN General Purpose Amplifier; Published: 8-Jun-2000; LatestRevisionDate: 15-Jan-2003; LatestRevisionNote: PCB Footprint 'BCY-W3/D4.7' replaced; DatasheetVersion: 1997; PackageVersion: Sep-1998; PackageReference: TO-92A; Publisher: Altium Limited; Code_JEDEC: TO-92A; ComponentLink1Description: Manufacturer Link; ComponentLink1URL: http://www.fairchildsemi.com/; ComponentLink2Description: Datasheet; ComponentLink2URL: http://www.fairchildsemi.com/ds/2N%2F2N3904.pdf
Q2#2 = PNP: PNP Bipolar Transistor; Published: 8-Jun-2000; LatestRevisionDate: 17-Jul-2002; LatestRevisionNote: Re-released for DXP Platform.; PackageReference: SOT-23B; Publisher: Altium Limited; Code_JEDEC: SOT-23
Q10#2 = 2N3904: NPN General Purpose Amplifier; Published: 8-Jun-2000; LatestRevisionDate: 15-Jan-2003; LatestRevisionNote: PCB Footprint 'BCY-W3/D4.7' replaced; DatasheetDocument: 1997; PackageDocument: Sep-1998; PackageReference: TO-92A; Publisher: Altium Limited; Code_JEDEC: TO-92A; ComponentLink1Description: Manufacturer Link; ComponentLink1URL: http://www.fairchildsemi.com/; ComponentLink2Description: Datasheet; ComponentLink2URL: http://www.fairchildsemi.com/ds/2N%2F2N3904.pdf
R1#2 R2#2 R3#2 R4#2 R5#2 R6#2 R7 R8#2 R9#2 R10#2 R11#2 R12#2 R13#2 R14#2 R15#2 R16#2 R17#2 R18#2 R19#2 R20#2 R21-R26 R27#2 R28#2 R29#3 R30#3 R31#2 R32-R34 = Res1: Resistor; Published: 8-Jun-2000; LatestRevisionDate: 17-Jul-2002; LatestRevisionNote: Re-released for DXP Platform.; PackageReference: AXIAL-0.3; Publisher: Altium Limited
R35-R39 = Res2: Resistor; Published: 8-Jun-2000; LatestRevisionDate: 17-Jul-2002; LatestRevisionNote: Re-released for DXP Platform.; PackageReference: AXIAL-0.4; Publisher: Altium Limited
RELAY1#2 = Relay-DPDT: Dual-Pole Dual-Throw Relay; Published: 24-Mar-1999; LatestRevisionDate: 17-Jul-2002; LatestRevisionNote: Re-released for DXP Platform.; PackageReference: DIP-P8; Publisher: Altium Limited

## Nets that join several sheets
M-: Concentrator (58 pins), SIM800 (15 pins), JunPuMBUS (27 pins)
VCC_3.3V: Concentrator (25 pins), JunPuMBUS (5 pins)
VCC_12V: Concentrator (14 pins), SIM800 (C21.1 P5#2.1 U7.1), JunPuMBUS (8 pins)
GPRS_RX: Concentrator (P3.4 U3#1.42), SIM800 (P5#2.4 U8.7)
GPRS_TX: Concentrator (P3.5 U3#1.43), SIM800 (P5#2.5 U8.8)
M+: Concentrator (P4#1.7 P6.5), JunPuMBUS (5 pins)
NETLIGHT: Concentrator (P3.6 R4#1.1), SIM800 (P5#2.6 U8.5)
OVER: Concentrator (P4#1.3 U3#1.37), JunPuMBUS (P4#2.3 R31#2.1 U4#2.7)
VALVE: Concentrator (P4#1.4 U3#1.36), JunPuMBUS (P4#2.4 R35.1)